# EAGLE design espdh11new (EAGLE 7.5.0)
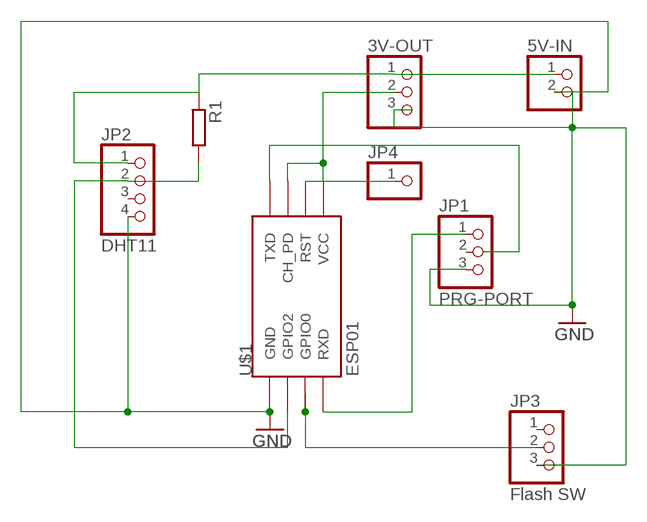
[diagram p0: schematic, sheet 1]

## Parts
3V-OUT  PINHD-1X3  [1X03]
5V-IN  PINHD-1X2  [1X02]
JP1  PRG-PORT  PINHD-1X3  [1X03]
JP2  DHT11  PINHD-1X4  [1X04]
JP3  Flash SW  PINHD-1X3/90  [1X03/90]
JP4  PINHD-1X1  [1X01]
R1  R-EU_0204/5  [0204/5]
U$1  ESP01  [ESP01]

## Nets
5V: 3V-OUT.1 5V-IN.1 JP2.1 R1.1
GND: 3V-OUT.3 5V-IN.2 JP1.3 JP2.4 JP3.3 U$1.GND
GPIO2: JP2.2 R1.2 U$1.GPIO2
N$1: JP3.2 U$1.GPIO0
N$2: 3V-OUT.2 U$1.CH_PD U$1.VCC
RESET: JP4.1 U$1.RST
RXD: JP1.1 U$1.RX(RXD)
TXD: U$1.TX(TXD)
Unconnected: JP1.2 JP2.3 JP3.1

## Library data of the parts
3V-OUT JP1 JP3 = pinhead:PINHD-1X3: PIN HEADER
5V-IN = pinhead:PINHD-1X2: PIN HEADER
JP2 = pinhead:PINHD-1X4: PIN HEADER
JP4 = pinhead:PINHD-1X1: PIN HEADER
R1 = resistor:R-EU_: RESISTOR, European symbol
U$1 = esp8266modules:ESP01: ESP8266 Wifi module 01

## Board
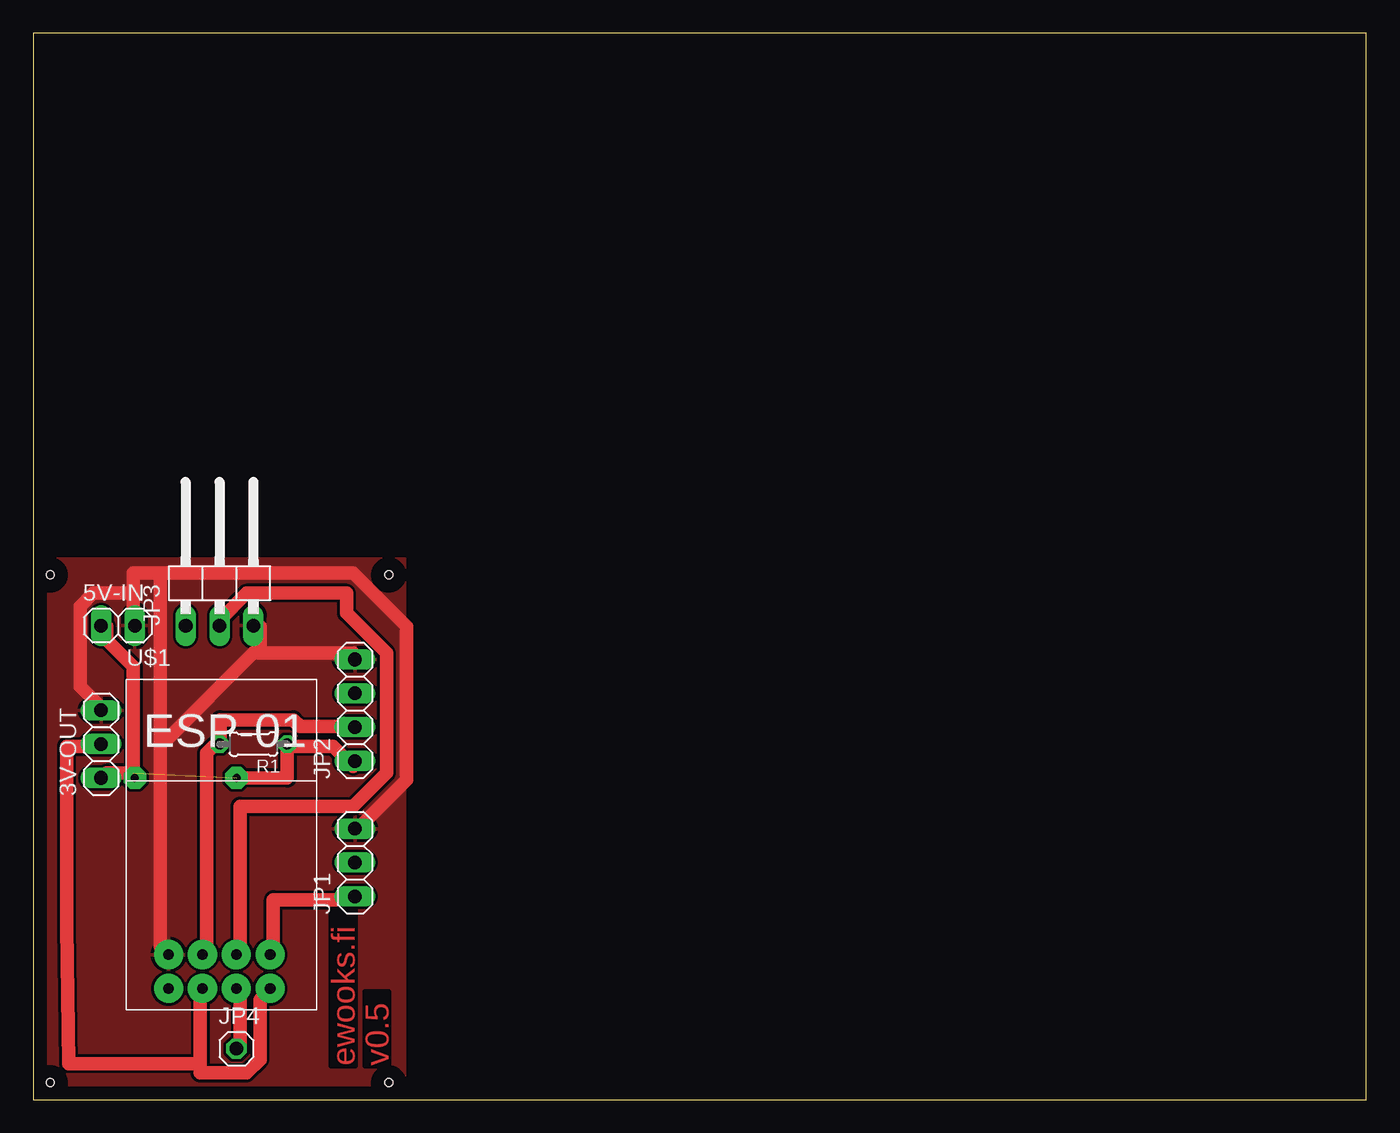
[diagram p1: board, top side]

Size 100 x 80 mm. Coordinates in mm from the lower left corner, seen from the top.
Outline: 0,0 100,0 100,80 0,80 0,0
Copper layers (1*16): Top 0.035mm / dielectric 1.5mm / Bottom 0.035mm
Design rules "default *": minimum track width 40mil, minimum drill 24mil, track to track 8mil, track to pad 8mil, pad to pad 8mil, via to via 8mil, smd to smd 8mil, copper to edge 40mil, drill to drill 8mil, minimum pad ring 10mil, minimum via ring 8mil, stop-mask expansion 4mil, vias tented up to drill 0mil, thermal gap 10mil
Holes 0.6 mm at 1.27,39.37 26.67,39.37 1.27,1.27 26.67,1.27

### Footprints (pad centres in the part's own frame; a part is rotated, then mirrored left to right if it is on the bottom)
1X03 = drill 1.016 long: 1 -2.54,0; 2 0,0; 3 2.54,0
1X02 = drill 1.016 long: 1 -1.27,0; 2 1.27,0
1X04 = drill 1.016 long: 1 -3.81,0; 2 -1.27,0; 3 1.27,0; 4 3.81,0
1X03/90 = drill 1.016 long: 1 -2.54,-3.81; 2 0,-3.81; 3 2.54,-3.81
1X01 = drill 1.016 octagon: 1 0,0
0204/5 = drill 0.813 octagon: 1 -2.54,0; 2 2.54,0
ESP01 = drill 0.8 pad 2.184: CH_PD -1.285,-8.178; GND -3.825,-5.638; GPIO0 1.255,-5.638; GPIO2 -1.285,-5.638; RST 1.255,-8.178; RX 3.795,-5.638; TX -3.825,-8.178; VCC 3.795,-8.178

### Placement (x,y rotation side)
3V-OUT  5.08,26.67 90 top
5V-IN  6.35,35.56 0 top
JP1  24.13,17.78 90 top
JP2  24.13,29.21 90 top
JP3  13.97,39.37 0 top
JP4  15.24,3.81 0 top
R1  16.51,26.67 180 top
U$1  13.97,16.51 0 top

### Tracks (layer width: path | path; a pad name or v marks a point on that pad's centre or on a via)
5V  (via drill 0.6 pad 1.68)  (1 unrouted)
  Top 1.016: 3V-OUT.1 5.5,24.5 7.5,24.5 7.5,32.5 5.5,34.5 5.5,35.5 5V-IN.1 | JP2.1 24,25 22.5,26.5 19.5,26.5 R1.1 19.05,24.13 v15.24,24.13
GND
  Top 1.016: 17,33.5 24,33.5 JP2.4 | 17,33.5 17,35.5 JP3.3 | 7.5,38 4.5,38 3.5,37 3.5,31 5,29.5 3V-OUT.3 | 7.5,38 7.5,36 5V-IN.2 | 9.5,39.5 7.5,39.5 7.5,38 | 9.5,39.5 24,39.5 28,35.5 28,24 24.5,20.5 JP1.3 | 9.5,39.5 9.5,27 | 9.5,27 9.5,11.5 10,11 U$1.GND | 17,33.5 16.5,33.5 10,27 9.5,27
  pour Top (isolate 0.125, rank 6): 0,40.64 27.94,40.64 27.94,0 0,0
GPIO2
  Top 1.016: U$1.GPIO2 13,11 13,26 13.5,26.5 R1.2 14,27 14,28.5 19.5,28.5 20,28 24,28 JP2.2
N$1
  Top 1.016: JP3.2 14,36 16,38 23.5,38 23.5,36.5 26.5,33.5 26.5,24.5 24,22 15.5,22 15.5,11 U$1.GPIO0
N$2
  Top 1.016: 12.5,2.69 2.65,2.69 2.5,13 2.5,26.5 5,26.5 3V-OUT.2 | 12.5,2.69 12.5,8 U$1.CH_PD | 12.5,2.69 12.5,2 16,2 17,3 17,7.5 17.5,8 U$1.VCC
N$3  (via drill 0.6 pad 1.68)
  other vias: 7.62,24.13
RESET
  Top 1.016: JP4.1 15.5,4 15.5,8 U$1.RST
RXD
  Top 1.016: JP1.1 22.73,15 18,15 18,11 U$1.RX

### Text on the board
Top: ewooks.fi | v0.5